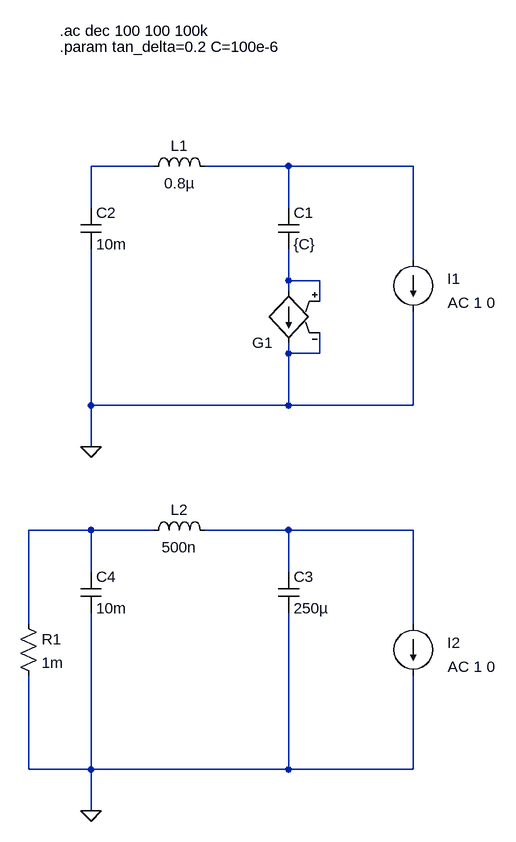
[diagram p0: schematic capacitive_decoupling.asc]
capacitive_decoupling.asc, the LTspice schematic file:
Version 4
SHEET 1 1304 724
WIRE 656 -288 560 -288
WIRE 864 -288 736 -288
WIRE 1056 -288 864 -288
WIRE 560 -224 560 -288
WIRE 864 -224 864 -288
WIRE 1056 -144 1056 -288
WIRE 864 -112 864 -160
WIRE 912 -112 864 -112
WIRE 864 -96 864 -112
WIRE 912 -80 912 -112
WIRE 864 0 864 -16
WIRE 912 0 912 -32
WIRE 912 0 864 0
WIRE 560 80 560 -160
WIRE 864 80 864 0
WIRE 864 80 560 80
WIRE 1056 80 1056 -64
WIRE 1056 80 864 80
WIRE 560 144 560 80
WIRE 560 272 464 272
WIRE 656 272 560 272
WIRE 864 272 736 272
WIRE 1056 272 864 272
WIRE 560 336 560 272
WIRE 864 336 864 272
WIRE 464 416 464 272
WIRE 1056 416 1056 272
WIRE 464 640 464 496
WIRE 560 640 560 400
WIRE 560 640 464 640
WIRE 864 640 864 400
WIRE 864 640 560 640
WIRE 1056 640 1056 496
WIRE 1056 640 864 640
WIRE 560 704 560 640
FLAG 560 144 0
FLAG 560 704 0
SYMBOL g2 864 0 R180
WINDOW 3 -436 57 Invisible 2
SYMATTR Value Laplace=abs(s)*{C}/{tan_delta}
SYMATTR InstName G1
SYMBOL cap 848 -224 R0
SYMATTR InstName C1
SYMATTR Value {C}
SYMBOL ind 640 -272 R270
WINDOW 0 32 56 VTop 2
WINDOW 3 5 56 VBottom 2
SYMATTR InstName L1
SYMATTR Value 0.8µ
SYMATTR SpiceLine Rser=1m
SYMBOL cap 544 -224 R0
SYMATTR InstName C2
SYMATTR Value 10m
SYMBOL current 1056 -144 R0
WINDOW 0 52 29 Left 2
WINDOW 123 53 66 Left 2
WINDOW 39 0 0 Left 0
SYMATTR InstName I1
SYMATTR Value2 AC 1 0
SYMATTR Value ""
SYMBOL cap 848 336 R0
SYMATTR InstName C3
SYMATTR Value 250µ
SYMATTR SpiceLine Rser=10m
SYMBOL ind 640 288 R270
WINDOW 0 32 56 VTop 2
WINDOW 3 5 56 VBottom 2
SYMATTR InstName L2
SYMATTR Value 500n
SYMATTR SpiceLine Rser=10m
SYMBOL cap 544 336 R0
SYMATTR InstName C4
SYMATTR Value 10m
SYMATTR SpiceLine Rser=10m
SYMBOL current 1056 416 R0
WINDOW 0 52 29 Left 2
WINDOW 123 53 66 Left 2
WINDOW 39 0 0 Left 0
SYMATTR InstName I2
SYMATTR Value2 AC 1 0
SYMATTR Value ""
SYMBOL res 448 400 R0
SYMATTR InstName R1
SYMATTR Value 1m
TEXT 512 -472 Left 2 !.param tan_delta=0.2 C=100e-6
TEXT 512 -496 Left 2 !.ac dec 100 100 100k

The netlist it stands for:
* capacitive_decoupling.asc
G1 N003 0 N003 0 Laplace=abs(s)*{C}/{tan_delta}
C1 N002 N003 {C}
L1 N001 N002 0.8µ Rser=1m
C2 N001 0 10m
I1 N002 0 AC 1 0
C3 N005 0 250µ Rser=10m
L2 N004 N005 500n Rser=10m
C4 N004 0 10m Rser=10m
I2 N005 0 AC 1 0
R1 N004 0 1m
.param tan_delta=0.2 C=100e-6
.ac dec 100 100 100k
.backanno
.end